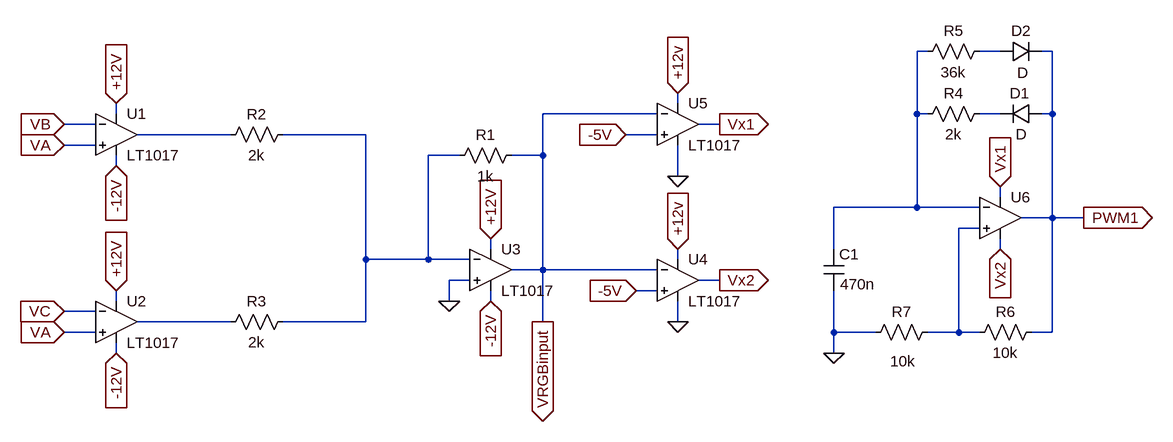
[diagram p0: schematic comparing unit.asc]
comparing unit.asc, the LTspice schematic file:
Version 4
SHEET 1 2292 1172
WIRE 1920 -400 1904 -400
WIRE 2032 -400 2000 -400
WIRE 2112 -400 2096 -400
WIRE 1536 -320 1536 -336
WIRE 672 -304 672 -320
WIRE 1504 -304 1328 -304
WIRE 1904 -304 1904 -400
WIRE 1920 -304 1904 -304
WIRE 2032 -304 2000 -304
WIRE 2112 -304 2112 -400
WIRE 2112 -304 2096 -304
WIRE 640 -288 592 -288
WIRE 1600 -288 1568 -288
WIRE 848 -272 704 -272
WIRE 1056 -272 928 -272
WIRE 1504 -272 1456 -272
WIRE 640 -256 592 -256
WIRE 1200 -240 1152 -240
WIRE 1328 -240 1328 -304
WIRE 1328 -240 1280 -240
WIRE 672 -224 672 -240
WIRE 1536 -208 1536 -256
WIRE 2032 -176 2032 -192
WIRE 1904 -160 1904 -304
WIRE 1904 -160 1776 -160
WIRE 2000 -160 1904 -160
WIRE 2112 -144 2112 -304
WIRE 2112 -144 2064 -144
WIRE 2160 -144 2112 -144
WIRE 2000 -128 1968 -128
WIRE 1248 -96 1248 -112
WIRE 1776 -96 1776 -160
WIRE 2032 -96 2032 -112
WIRE 1056 -80 1056 -272
WIRE 1152 -80 1152 -240
WIRE 1152 -80 1056 -80
WIRE 1216 -80 1152 -80
WIRE 1536 -80 1536 -96
WIRE 1328 -64 1328 -240
WIRE 1328 -64 1280 -64
WIRE 1504 -64 1328 -64
WIRE 1216 -48 1184 -48
WIRE 1600 -48 1568 -48
WIRE 1504 -32 1472 -32
WIRE 672 -16 672 -32
WIRE 1184 -16 1184 -48
WIRE 1248 -16 1248 -32
WIRE 640 0 592 0
WIRE 848 16 704 16
WIRE 1056 16 1056 -80
WIRE 1056 16 928 16
WIRE 1328 16 1328 -64
WIRE 1536 16 1536 -16
WIRE 640 32 592 32
WIRE 1776 32 1776 -32
WIRE 1840 32 1776 32
WIRE 1968 32 1968 -128
WIRE 1968 32 1920 32
WIRE 2000 32 1968 32
WIRE 2112 32 2112 -144
WIRE 2112 32 2080 32
WIRE 672 64 672 48
WIRE 1776 64 1776 32
FLAG 592 -256 VA
IOPIN 592 -256 In
FLAG 592 0 VC
IOPIN 592 0 In
FLAG 672 -320 +12V
IOPIN 672 -320 In
FLAG 672 -32 +12V
IOPIN 672 -32 In
FLAG 672 -224 -12V
IOPIN 672 -224 In
FLAG 672 64 -12V
IOPIN 672 64 In
FLAG 592 32 VA
IOPIN 592 32 In
FLAG 1248 -112 +12V
IOPIN 1248 -112 In
FLAG 592 -288 VB
IOPIN 592 -288 In
FLAG 1184 -16 0
FLAG 1248 -16 -12V
IOPIN 1248 -16 In
FLAG 1456 -272 -5V
IOPIN 1456 -272 In
FLAG 1472 -32 -5V
IOPIN 1472 -32 In
FLAG 1536 -336 +12v
IOPIN 1536 -336 In
FLAG 1536 -96 +12v
IOPIN 1536 -96 In
FLAG 1536 -208 0
FLAG 1536 16 0
FLAG 1776 64 0
FLAG 1600 -48 Vx2
IOPIN 1600 -48 Out
FLAG 1600 -288 Vx1
IOPIN 1600 -288 Out
FLAG 2032 -96 Vx2
IOPIN 2032 -96 In
FLAG 2032 -192 Vx1
IOPIN 2032 -192 In
FLAG 2160 -144 PWM1
IOPIN 2160 -144 Out
FLAG 1328 16 VRGBinput
IOPIN 1328 16 Out
SYMBOL Comparators\\LT1017 672 -272 R0
SYMATTR InstName U1
SYMBOL Comparators\\LT1017 672 16 R0
SYMATTR InstName U2
SYMBOL Comparators\\LT1017 1248 -64 R0
SYMATTR InstName U3
SYMBOL res 944 -288 R90
WINDOW 0 0 56 VBottom 2
WINDOW 3 32 56 VTop 2
SYMATTR InstName R2
SYMATTR Value 2k
SYMBOL res 944 0 R90
WINDOW 0 0 56 VBottom 2
WINDOW 3 32 56 VTop 2
SYMATTR InstName R3
SYMATTR Value 2k
SYMBOL Comparators\\LT1017 1536 -48 R0
SYMATTR InstName U4
SYMBOL Comparators\\LT1017 1536 -288 R0
SYMATTR InstName U5
SYMBOL res 1296 -256 R90
WINDOW 0 0 56 VBottom 2
WINDOW 3 32 56 VTop 2
SYMATTR InstName R1
SYMATTR Value 1k
SYMBOL Opamps\\UniversalOpamp2 2032 -144 R0
SYMATTR InstName U6
SYMBOL diode 2096 -320 R90
WINDOW 0 0 34 VBottom 2
WINDOW 3 32 32 VTop 2
SYMATTR InstName D1
SYMBOL diode 2032 -384 R270
WINDOW 0 32 32 VTop 2
WINDOW 3 -1 35 VBottom 2
SYMATTR InstName D2
SYMBOL res 2096 16 R90
WINDOW 0 0 56 VBottom 2
WINDOW 3 32 56 VTop 2
SYMATTR InstName R6
SYMATTR Value 10k
SYMBOL cap 1760 -96 R0
WINDOW 3 26 54 Left 2
SYMATTR Value 470n
SYMATTR InstName C1
SYMBOL res 1936 16 R90
WINDOW 0 0 56 VBottom 2
WINDOW 3 45 54 VTop 2
SYMATTR InstName R7
SYMATTR Value 10k
SYMBOL res 2016 -320 R90
WINDOW 0 0 56 VBottom 2
WINDOW 3 32 56 VTop 2
SYMATTR InstName R4
SYMATTR Value 2k
SYMBOL res 2016 -416 R90
WINDOW 0 0 56 VBottom 2
WINDOW 3 32 56 VTop 2
SYMATTR InstName R5
SYMATTR Value 36k

The netlist it stands for:
* comparing unit.asc
XU1 VA VB +12V -12V N004 LT1017  ; pins In+ In- V+ V- OUT
XU2 VA VC +12V -12V N007 LT1017  ; pins In+ In- V+ V- OUT
XU3 0 N005 +12V -12V VRGBinput LT1017  ; pins In+ In- V+ V- OUT
R2 N005 N004 2k
R3 N005 N007 2k
XU4 -5V VRGBinput +12V 0 Vx2 LT1017  ; pins In+ In- V+ V- OUT
XU5 -5V VRGBinput +12V 0 Vx1 LT1017  ; pins In+ In- V+ V- OUT
R1 VRGBinput N005 1k
XU6 N006 N001 Vx1 Vx2 PWM1 level.2 Avol=1Meg GBW=10Meg Slew=10Meg ilimit=25m rail=0 Vos=0 phimargin=45 en=0 enk=0 in=0 ink=0 Rin=500Meg  ; pins IN+ IN- V+ V- OUT
D1 PWM1 N003 D
D2 N002 PWM1 D
R6 PWM1 N006 10k
C1 N001 0 470n
R7 N006 0 10k
R4 N003 N001 2k
R5 N002 N001 36k
.model D D
.lib standard.dio
.lib UniversalOpamps2.sub
.backanno
.end